# Altium schematic sheet FMC_HPC_UFL_DEBUG_HPC_GH.SchDoc: HPC connector ROW G and ROW H
size A4; Date: 13.12.2024; ApprovedBy: PFH; CompanyName: IAM Electronic GmbH; DrawnBy: PFH; Engineer: PFH; DocumentNumber: 8; Revision: A; SheetNumber: 8; SheetTotal: 9; Projekt: FMC HPC-U.FL Debug Board; Website: www.fmchub.com
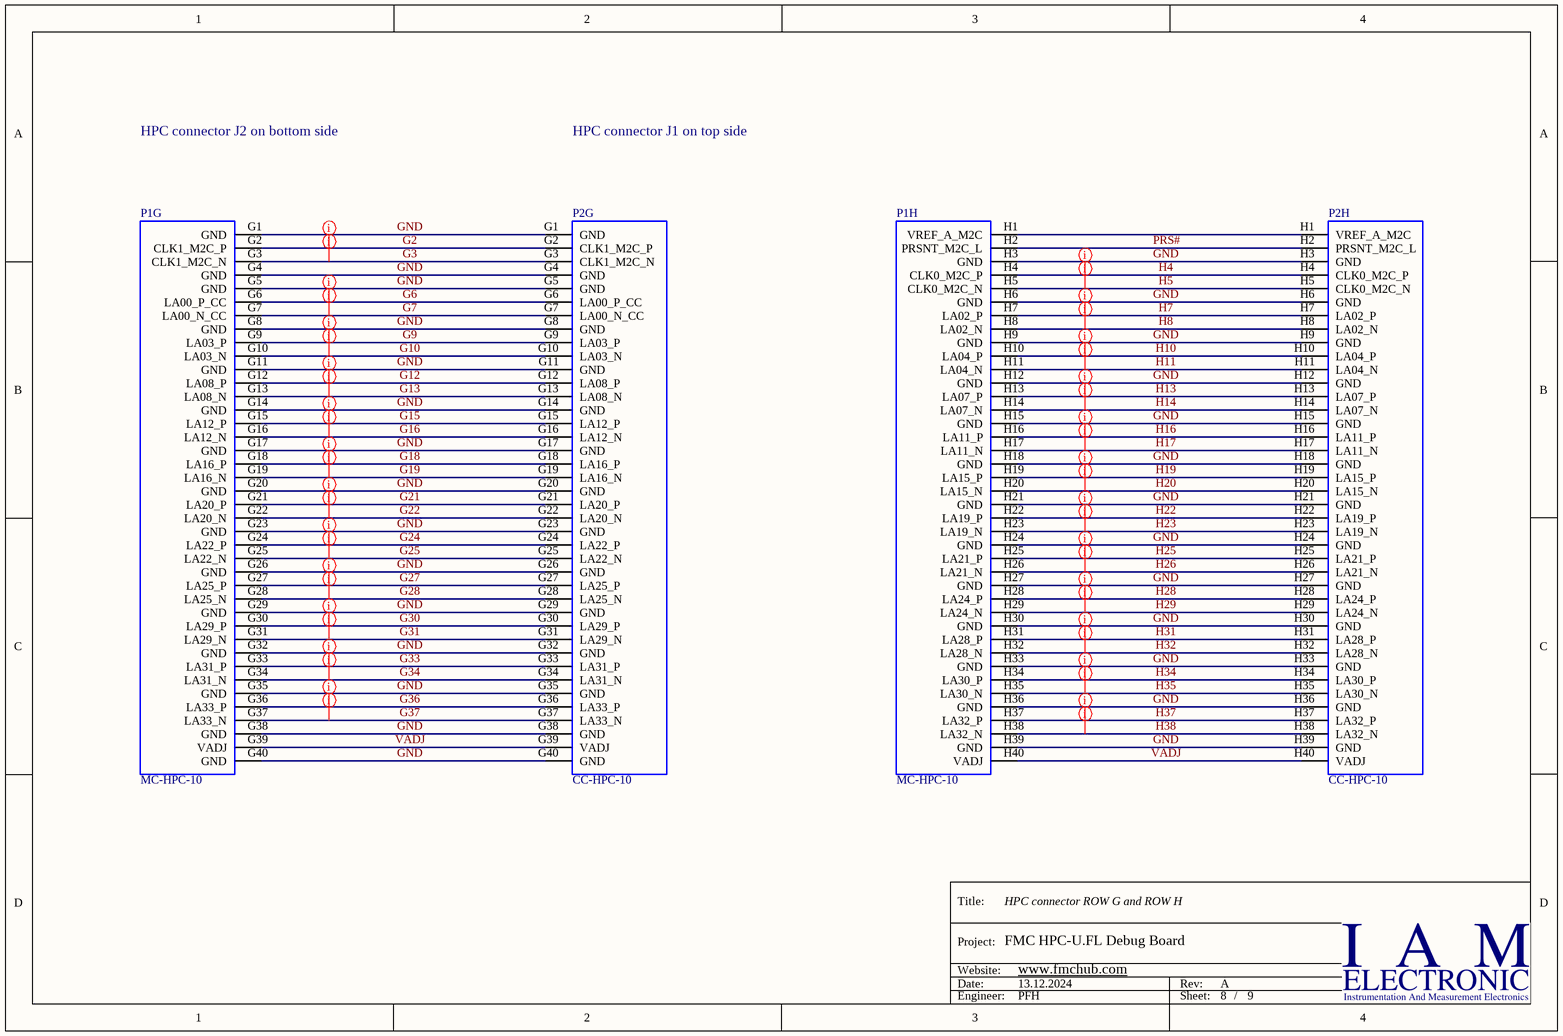
[diagram p0: FMC_HPC_UFL_DEBUG_HPC_GH.SchDoc]

## Parts
P1  MC-HPC-10  [ASP-134488-01]  (parts G,H of 10)
P2  CC-HPC-10  [ASP-134486-01]  (parts G,H of 10)

## Nets
G2: P1.G2(CLK1_M2C_P) P2.G2(CLK1_M2C_P)
G3: P1.G3(CLK1_M2C_N) P2.G3(CLK1_M2C_N)
G6: P1.G6(LA00_P_CC) P2.G6(LA00_P_CC)
G7: P1.G7(LA00_N_CC) P2.G7(LA00_N_CC)
G9: P1.G9(LA03_P) P2.G9(LA03_P)
G10: P1.G10(LA03_N) P2.G10(LA03_N)
G12: P1.G12(LA08_P) P2.G12(LA08_P)
G13: P1.G13(LA08_N) P2.G13(LA08_N)
G15: P1.G15(LA12_P) P2.G15(LA12_P)
G16: P1.G16(LA12_N) P2.G16(LA12_N)
G18: P1.G18(LA16_P) P2.G18(LA16_P)
G19: P1.G19(LA16_N) P2.G19(LA16_N)
G21: P1.G21(LA20_P) P2.G21(LA20_P)
G22: P1.G22(LA20_N) P2.G22(LA20_N)
G24: P1.G24(LA22_P) P2.G24(LA22_P)
G25: P1.G25(LA22_N) P2.G25(LA22_N)
G27: P1.G27(LA25_P) P2.G27(LA25_P)
G28: P1.G28(LA25_N) P2.G28(LA25_N)
G30: P1.G30(LA29_P) P2.G30(LA29_P)
G31: P1.G31(LA29_N) P2.G31(LA29_N)
G33: P1.G33(LA31_P) P2.G33(LA31_P)
G34: P1.G34(LA31_N) P2.G34(LA31_N)
G36: P1.G36(LA33_P) P2.G36(LA33_P)
G37: P1.G37(LA33_N) P2.G37(LA33_N)
GND: P1.G1(GND) P1.G4(GND) P1.G5(GND) P1.G8(GND) P1.G11(GND) P1.G14(GND) P1.G17(GND) P1.G20(GND) P1.G23(GND) P1.G26(GND) P1.G29(GND) P1.G32(GND) P1.G35(GND) P1.G38(GND) P1.G40(GND) P1.H3(GND) P1.H6(GND) P1.H9(GND) P1.H12(GND) P1.H15(GND) P1.H18(GND) P1.H21(GND) P1.H24(GND) P1.H27(GND) P1.H30(GND) P1.H33(GND) P1.H36(GND) P1.H39(GND) P2.G1(GND) P2.G4(GND) P2.G5(GND) P2.G8(GND) P2.G11(GND) P2.G14(GND) P2.G17(GND) P2.G20(GND) P2.G23(GND) P2.G26(GND) P2.G29(GND) P2.G32(GND) P2.G35(GND) P2.G38(GND) P2.G40(GND) P2.H3(GND) P2.H6(GND) P2.H9(GND) P2.H12(GND) P2.H15(GND) P2.H18(GND) P2.H21(GND) P2.H24(GND) P2.H27(GND) P2.H30(GND) P2.H33(GND) P2.H36(GND) P2.H39(GND)
H4: P1.H4(CLK0_M2C_P) P2.H4(CLK0_M2C_P)
H5: P1.H5(CLK0_M2C_N) P2.H5(CLK0_M2C_N)
H7: P1.H7(LA02_P) P2.H7(LA02_P)
H8: P1.H8(LA02_N) P2.H8(LA02_N)
H10: P1.H10(LA04_P) P2.H10(LA04_P)
H11: P1.H11(LA04_N) P2.H11(LA04_N)
H13: P1.H13(LA07_P) P2.H13(LA07_P)
H14: P1.H14(LA07_N) P2.H14(LA07_N)
H16: P1.H16(LA11_P) P2.H16(LA11_P)
H17: P1.H17(LA11_N) P2.H17(LA11_N)
H19: P1.H19(LA15_P) P2.H19(LA15_P)
H20: P1.H20(LA15_N) P2.H20(LA15_N)
H22: P1.H22(LA19_P) P2.H22(LA19_P)
H23: P1.H23(LA19_N) P2.H23(LA19_N)
H25: P1.H25(LA21_P) P2.H25(LA21_P)
H26: P1.H26(LA21_N) P2.H26(LA21_N)
H28: P1.H28(LA24_P) P2.H28(LA24_P)
H29: P1.H29(LA24_N) P2.H29(LA24_N)
H31: P1.H31(LA28_P) P2.H31(LA28_P)
H32: P1.H32(LA28_N) P2.H32(LA28_N)
H34: P1.H34(LA30_P) P2.H34(LA30_P)
H35: P1.H35(LA30_N) P2.H35(LA30_N)
H37: P1.H37(LA32_P) P2.H37(LA32_P)
H38: P1.H38(LA32_N) P2.H38(LA32_N)
PRS#: P1.H2(PRSNT_M2C_L) P2.H2(PRSNT_M2C_L)
VADJ: P1.G39(VADJ) P1.H40(VADJ) P2.G39(VADJ) P2.H40(VADJ)
NetP1_H1: P1.H1(VREF_A_M2C) P2.H1(VREF_A_M2C)

## Layout directives
rule Width Constraint [Pref Impedance = 50,00ohms    Min Impedance = 50,00ohms    Max Impedance = 50,00ohms]; net class FMC_LA: G6, G7, G9, G10, G12, G13, G15, G16, G18, G19, G21, G22, G24, G25, G27, G28, G30, G31, G33, G34, G36, G37, H7, H8, H10, H11, H13, H14, H16, H17, H19, H20, H22, H23, H25, H26, H28, H29, H31, H32, H34, H35, H37, H38
rule Width Constraint [Pref Impedance = 50,00ohms    Min Impedance = 50,00ohms    Max Impedance = 50,00ohms]; net class FMC_CLK: G2, G3, H4, H5

## Notes on the sheet
- HPC connector J2 on bottom side
- HPC connector J1 on top side
- Title:
- Project:
- Date:
- Website:
- Rev:
- Engineer:
- Sheet:
- /

## Library data of the parts
P1 = MC-HPC-10: MC-HPC-10, FMC High-pin count connector, lead free, 400 I/Os, male, 10 mm mated stack height; Manufacturer: Samtec; Manufacturer Ref: SEAM-40-03.5-S-10-2-A-K-TR-VITA57.0; Pitch: 1.27 mm; Mated Stack Height: 10 mm; Solder Type: Lead-Free; Number I/O: 400; PartName: ASP-134488-01; Part: ASP-134488-01; Vita PartNumber: MC-HPC-10; Pin Count: High; Gender: male; Supplier 1: Digi-Key; Supplier Part Number 1: SAM8730-ND
P2 = CC-HPC-10: CC-HPC-10, FMC High-pin count connector, lead free, 400 I/Os, female, 10 mm mated stack height; Manufacturer: Samtec; Manufacturer Ref: SEAF-40-06.5-10-A; Pitch: 1.27 mm; Mated Stack Height: 10 mm; Solder Type: Lead-Free; Number I/O: 400; PartName: ASP-134486-01; Part: ASP-134486-01; Vita PartNumber: CC-HPC-10; Pin Count: High; Gender: female; Supplier 1: Digi-Key; Supplier Part Number 1: SAM8728-ND